# EAGLE schematic MyoWare_Cable_Shield (EAGLE 7.7.0)
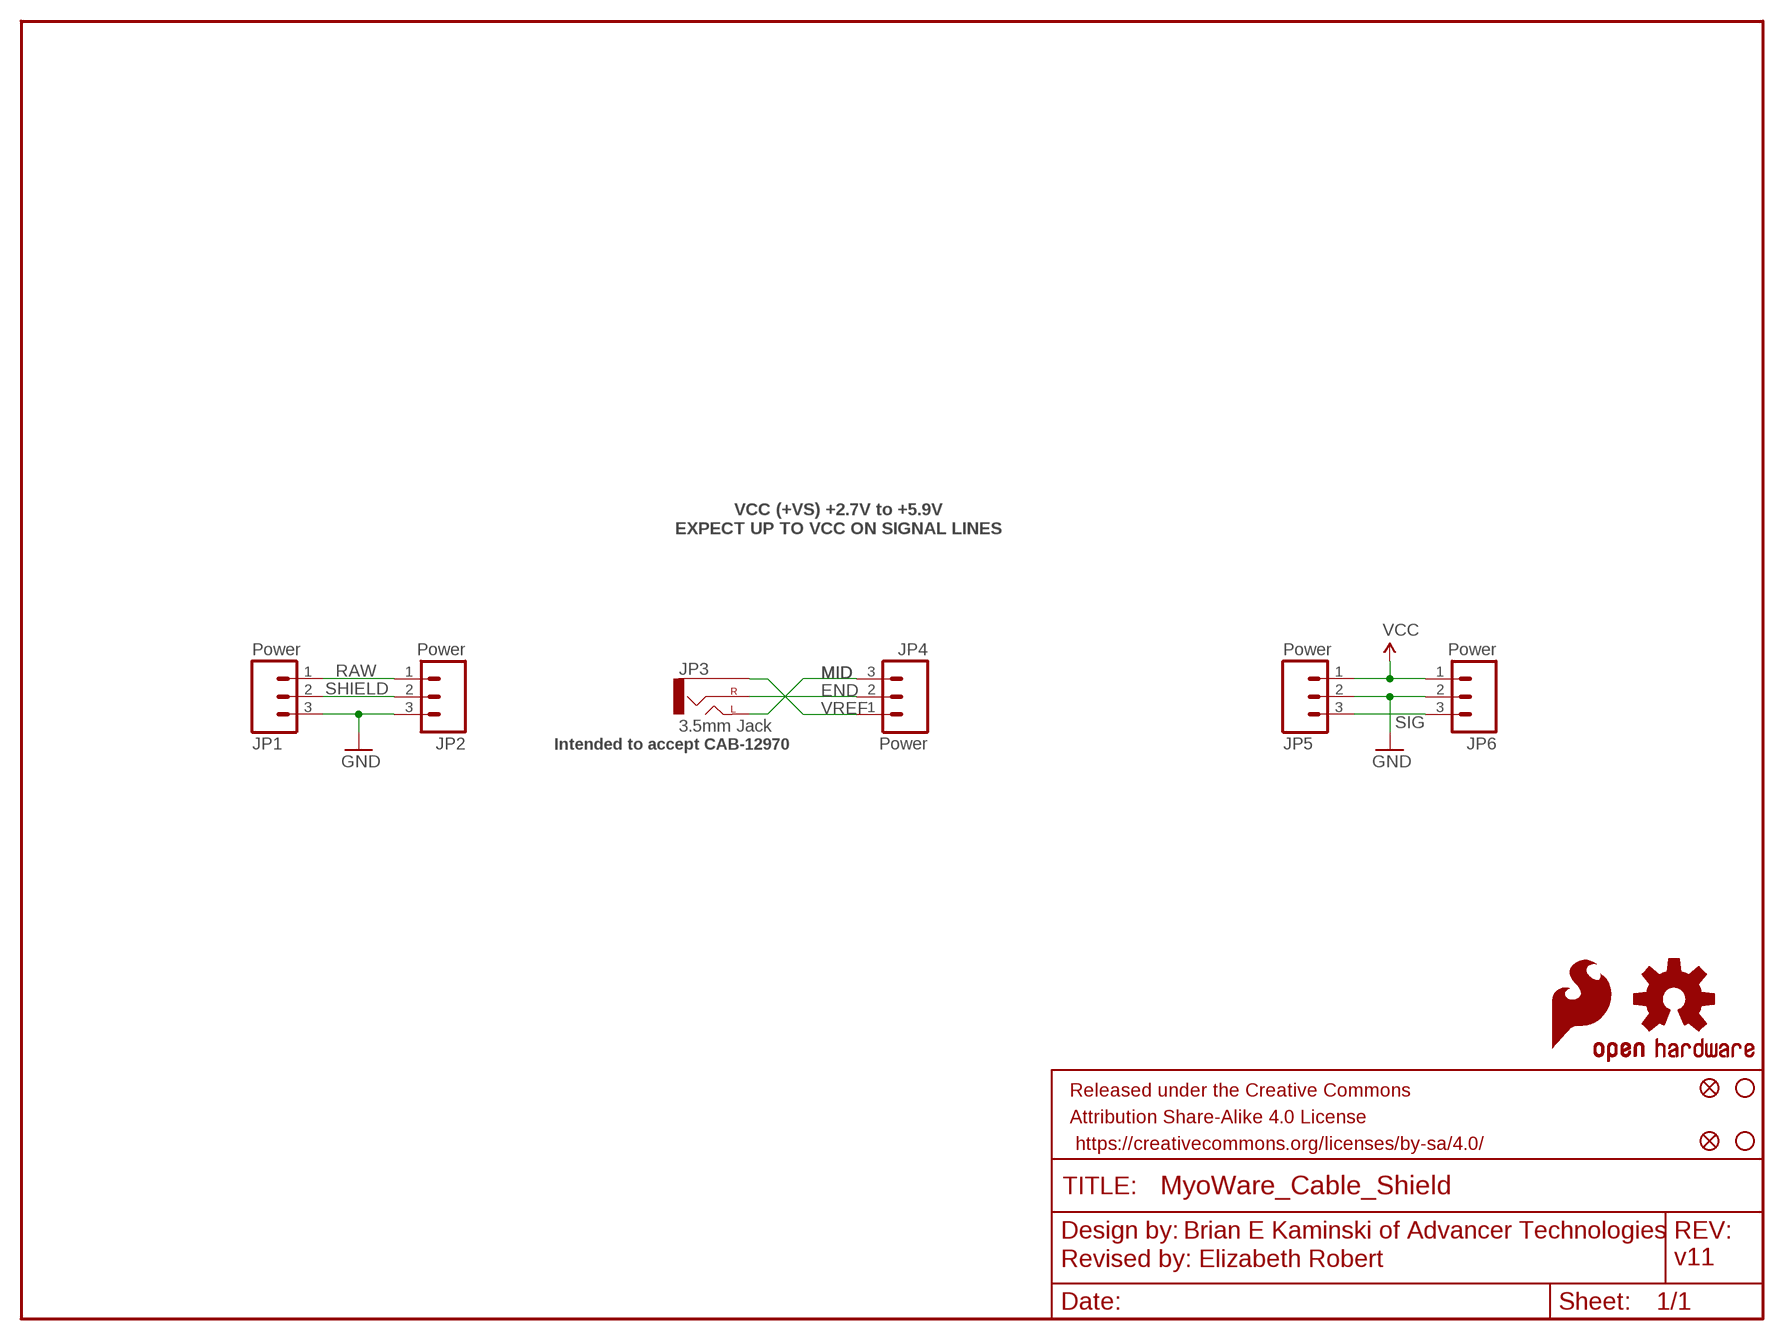
[diagram p0: schematic, sheet 1]

## Parts
FID1  FIDUCIAL1X2  [FIDUCIAL-1X2]
FID2  FIDUCIAL1X2  [FIDUCIAL-1X2]
FRAME1  FRAME-LETTER  [CREATIVE_COMMONS]
JP1  Power  M031X03_NO_SILK  [1X03_NO_SILK]
JP2  Power  M031X03_NO_SILK  [1X03_NO_SILK]
JP3  3.5mm Jack  AUDIO-JACKSMD2  [AUDIO-JACK-3.5MM-SMD]
JP4  Power  M031X03_NO_SILK  [1X03_NO_SILK]
JP5  Power  M031X03_NO_SILK  [1X03_NO_SILK]
JP6  Power  M031X03_NO_SILK  [1X03_NO_SILK]
LOGO1  SFE_LOGO_FLAME.2_INCH  [SFE_LOGO_FLAME_.2]
LOGO2  OSHW-LOGOM  [OSHW-LOGO-M]
STANDOFF1  STAND-OFF  [STAND-OFF]
STANDOFF2  STAND-OFF  [STAND-OFF]

## Nets
END: JP3.RING(RIGHT) JP4.2
GND: JP1.3 JP2.3 JP5.2 JP6.2
MID: JP3.TIP(LEFT) JP4.3
RAW: JP1.1 JP2.1
SHIELD: JP1.2 JP2.2
SIG: JP5.3 JP6.3
VCC: JP5.1 JP6.1
VREF: JP3.SLEEVE JP4.1

## Notes on the sheet
- VCC (+VS) +2.7V to +5.9V
  EXPECT UP TO VCC ON SIGNAL LINES
- Intended to accept CAB-12970
- Brian E Kaminski of Advancer Technologies
- Revised by: Elizabeth Robert | v11

## Library data of the parts
FID1 FID2 = SparkFun-Aesthetics:FIDUCIAL: Fiducial Alignment Points Various fiducial points for machine vision alignment.
FRAME1 = SparkFun-Aesthetics:FRAME-LETTER: Schematic Frame Standard 8.5x11 US Letter frame
JP1 JP2 JP4-JP6 = SparkFun-Connectors:M03: Header 3 Standard 3-pin 0.1" header. Use with straight break away headers (SKU : PRT-00116), right angle break away headers (PRT-00553), swiss pins (PRT-00743), machine pins (PRT-00117), and female headers (PRT-00115). Molex polarized connector foot print use with SKU : PRT-08232 with associated crimp pins and housings.
JP3 = SparkFun-Connectors:AUDIO-JACK: 3.5mm Audio Jack Simple 3.5mm common PCB mount audio jack. Variant PTH is our storefront SKU PRT-08032; PROD_ID: CONN-10353
LOGO1 = SparkFun-Aesthetics:SFE_LOGO_FLAME: SFE Logo, flame only This is the SparkFun flame logo. The logo on the schematic will always be the same size; the package variant is the height of the flame. Default layer for the logo on the board is tSilk.
LOGO2 = SparkFun-Aesthetics:OSHW-LOGO: Open Source Hardware Logo This logo indicates the piece of hardware it is found on incorporates a OSHW license and/or adheres to the definition of open source hardware found here: http://freedomdefined.org/OSHW
STANDOFF1 STANDOFF2 = SparkFun-Electromechanical:STAND-OFF: #4 Stand Off This is the mechanical footprint for a #4 phillips button head screw. Use the keepout ring to avoid running the screw head into surrounding components. SKU : PRT-00447